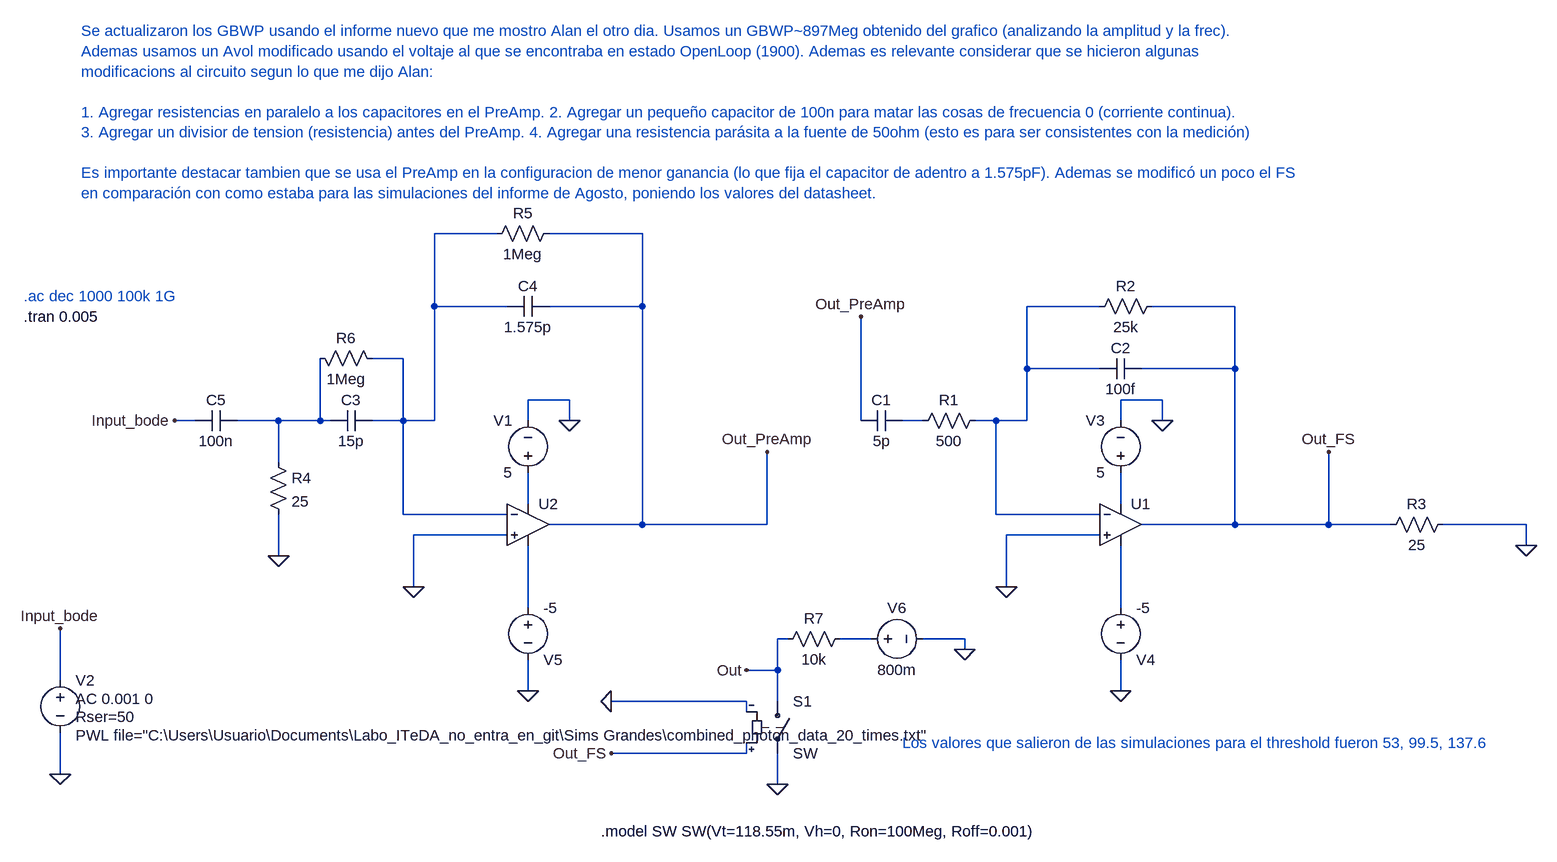
[diagram p0: schematic bode_circuito_completo_con_capacitores_en_preamp_inversor_actualizado.asc]
bode_circuito_completo_con_capacitores_en_preamp_inversor_actualizado.asc, the LTspice schematic file:
Version 4
SHEET 1 2516 1220
WIRE -832 -480 -928 -480
WIRE -608 -480 -752 -480
WIRE -928 -368 -928 -480
WIRE -816 -368 -928 -368
WIRE -608 -368 -608 -480
WIRE -608 -368 -752 -368
WIRE 96 -368 -16 -368
WIRE 304 -368 176 -368
WIRE -976 -288 -1024 -288
WIRE -16 -272 -16 -368
WIRE 96 -272 -16 -272
WIRE 304 -272 304 -368
WIRE 304 -272 160 -272
WIRE -720 -224 -784 -224
WIRE 192 -224 128 -224
WIRE -1296 -192 -1328 -192
WIRE -1168 -192 -1232 -192
WIRE -1104 -192 -1104 -288
WIRE -1104 -192 -1168 -192
WIRE -1088 -192 -1104 -192
WIRE -976 -192 -976 -288
WIRE -976 -192 -1024 -192
WIRE -928 -192 -928 -368
WIRE -928 -192 -976 -192
WIRE -784 -192 -784 -224
WIRE -720 -192 -720 -224
WIRE -272 -192 -272 -352
WIRE -176 -192 -208 -192
WIRE -64 -192 -96 -192
WIRE -16 -192 -16 -272
WIRE -16 -192 -64 -192
WIRE 128 -192 128 -224
WIRE 192 -192 192 -224
WIRE -1168 -128 -1168 -192
WIRE -784 -64 -784 -112
WIRE 128 -64 128 -112
WIRE -976 -48 -976 -192
WIRE -816 -48 -976 -48
WIRE -64 -48 -64 -192
WIRE 96 -48 -64 -48
WIRE -608 -32 -608 -368
WIRE -608 -32 -752 -32
WIRE -416 -32 -416 -144
WIRE -416 -32 -608 -32
WIRE 304 -32 304 -272
WIRE 304 -32 160 -32
WIRE 448 -32 448 -144
WIRE 448 -32 304 -32
WIRE 544 -32 448 -32
WIRE 752 -32 624 -32
WIRE -816 -16 -960 -16
WIRE 96 -16 -48 -16
WIRE 752 0 752 -32
WIRE -1168 16 -1168 -48
WIRE -960 64 -960 -16
WIRE -48 64 -48 -16
WIRE -784 96 -784 0
WIRE 128 96 128 0
WIRE -384 144 -400 144
WIRE -256 144 -304 144
WIRE -112 144 -176 144
WIRE -112 160 -112 144
WIRE -400 192 -400 144
WIRE -400 192 -448 192
WIRE -1504 208 -1504 128
WIRE -784 224 -784 176
WIRE 128 224 128 176
WIRE -448 240 -656 240
WIRE -400 240 -400 192
WIRE -448 256 -448 240
WIRE -448 320 -448 304
WIRE -448 320 -656 320
WIRE -1504 352 -1504 288
WIRE -400 368 -400 320
FLAG 192 -192 0
FLAG -48 64 0
FLAG 448 -144 Out_FS
FLAG 752 0 0
FLAG -272 -352 Out_PreAmp
FLAG -1504 352 0
FLAG -1504 128 Input_bode
FLAG -784 224 0
FLAG -720 -192 0
FLAG -960 64 0
FLAG -416 -144 Out_PreAmp
FLAG -1328 -192 Input_bode
FLAG -1168 16 0
FLAG 128 224 0
FLAG -400 368 0
FLAG -112 160 0
FLAG -448 192 Out
FLAG -656 240 0
FLAG -656 320 Out_FS
SYMBOL res -80 -208 R90
WINDOW 0 0 56 VBottom 2
WINDOW 3 32 56 VTop 2
SYMATTR InstName R1
SYMATTR Value 500
SYMBOL res 192 -384 R90
WINDOW 0 0 56 VBottom 2
WINDOW 3 32 56 VTop 2
SYMATTR InstName R2
SYMATTR Value 25k
SYMBOL voltage 128 -96 R180
WINDOW 0 24 96 Left 2
WINDOW 3 24 16 Left 2
WINDOW 123 0 0 Left 0
WINDOW 39 0 0 Left 0
SYMATTR InstName V3
SYMATTR Value 5
SYMBOL OpAmps\\UniversalOpAmp1 128 -32 R0
SYMATTR InstName U1
SYMATTR Value2 Avol=1900 GBW=897.0831Meg Vos=0
SYMBOL res 640 -48 R90
WINDOW 0 0 56 VBottom 2
WINDOW 3 32 56 VTop 2
SYMATTR InstName R3
SYMATTR Value 25
SYMBOL cap -208 -208 R90
WINDOW 0 0 32 VBottom 2
WINDOW 3 32 32 VTop 2
SYMATTR InstName C1
SYMATTR Value 5p
SYMBOL cap 160 -288 R90
WINDOW 0 0 32 VBottom 2
WINDOW 3 32 32 VTop 2
SYMATTR InstName C2
SYMATTR Value 100f
SYMBOL voltage -784 -96 R180
WINDOW 0 24 96 Left 2
WINDOW 3 24 16 Left 2
WINDOW 123 0 0 Left 0
WINDOW 39 0 0 Left 0
SYMATTR InstName V1
SYMATTR Value 5
SYMBOL voltage -784 80 R0
WINDOW 0 24 96 Left 2
WINDOW 3 24 16 Left 2
WINDOW 123 0 0 Left 0
WINDOW 39 0 0 Left 0
SYMATTR InstName V5
SYMATTR Value -5
SYMBOL OpAmps\\UniversalOpAmp1 -784 -32 R0
SYMATTR InstName U2
SYMATTR Value2 Avol=1900 GBW=897.0831Meg Vos=0
SYMBOL voltage -1504 192 R0
WINDOW 123 24 44 Left 2
WINDOW 39 24 72 Left 2
WINDOW 3 24 100 Left 2
SYMATTR Value2 AC 0.001 0
SYMATTR SpiceLine Rser=50
SYMATTR Value PWL file="C:\Users\Usuario\Documents\Labo_ITeDA_no_entra_en_git\Sims Grandes\combined_photon_data_20_times.txt"
SYMATTR InstName V2
SYMBOL cap -1024 -208 R90
WINDOW 0 0 32 VBottom 2
WINDOW 3 32 32 VTop 2
SYMATTR InstName C3
SYMATTR Value 15p
SYMBOL cap -752 -384 R90
WINDOW 0 0 32 VBottom 2
WINDOW 3 32 32 VTop 2
SYMATTR InstName C4
SYMATTR Value 1.575p
SYMBOL res -1184 -144 R0
SYMATTR InstName R4
SYMATTR Value 25
SYMBOL res -736 -496 R90
WINDOW 0 0 56 VBottom 2
WINDOW 3 32 56 VTop 2
SYMATTR InstName R5
SYMATTR Value 1Meg
SYMBOL res -1120 -304 M90
WINDOW 0 0 56 VBottom 2
WINDOW 3 32 56 VTop 2
SYMATTR InstName R6
SYMATTR Value 1Meg
SYMBOL voltage 128 80 R0
WINDOW 0 24 96 Left 2
WINDOW 3 24 16 Left 2
WINDOW 123 0 0 Left 0
WINDOW 39 0 0 Left 0
SYMATTR InstName V4
SYMATTR Value -5
SYMBOL cap -1232 -208 R90
WINDOW 0 0 32 VBottom 2
WINDOW 3 32 32 VTop 2
SYMATTR InstName C5
SYMATTR Value 100n
SYMBOL sw -400 224 R0
SYMATTR InstName S1
SYMBOL voltage -272 144 R270
WINDOW 0 32 56 VTop 2
WINDOW 3 -32 56 VBottom 2
WINDOW 123 0 0 Left 0
WINDOW 39 0 0 Left 0
SYMATTR InstName V6
SYMATTR Value 800m
SYMBOL res -288 128 R90
WINDOW 0 0 56 VBottom 2
WINDOW 3 32 56 VTop 2
SYMATTR InstName R7
SYMATTR Value 10k
TEXT -1560 -352 Left 2 !.tran 0.005
TEXT -1560 -384 Left 2 ;.ac dec 1000 100k 1G
TEXT -1472 -792 Left 2 ;Se actualizaron los GBWP usando el informe nuevo que me mostro Alan el otro dia. Usamos un GBWP~897Meg obtenido del grafico (analizando la amplitud y la frec).\nAdemas usamos un Avol modificado usando el voltaje al que se encontraba en estado OpenLoop (1900). Ademas es relevante considerar que se hicieron algunas\nmodificacions al circuito segun lo que me dijo Alan: \n \n1. Agregar resistencias en paralelo a los capacitores en el PreAmp. 2. Agregar un pequeño capacitor de 100n para matar las cosas de frecuencia 0 (corriente continua).\n3. Agregar un divisior de tension (resistencia) antes del PreAmp. 4. Agregar una resistencia parásita a la fuente de 50ohm (esto es para ser consistentes con la medición)\n \nEs importante destacar tambien que se usa el PreAmp en la configuracion de menor ganancia (lo que fija el capacitor de adentro a 1.575pF). Ademas se modificó un poco el FS\nen comparación con como estaba para las simulaciones del informe de Agosto, poniendo los valores del datasheet.
TEXT -672 440 Left 2 !.model SW SW(Vt=118.55m, Vh=0, Ron=100Meg, Roff=0.001)
TEXT -208 304 Left 2 ;Los valores que salieron de las simulaciones para el threshold fueron 53, 99.5, 137.6

The netlist it stands for:
* bode_circuito_completo_con_capacitores_en_preamp_inversor_actualizado.asc
R1 N002 N004 500
R2 Out_FS N002 25k
V3 N006 0 5
XU1 0 N002 N006 N008 Out_FS level1 Avol=1900 GBW=897.0831Meg Vos=0 En=0 Enk=0 In=0 Ink=0 Rin=500Meg  ; pins In+ In- V+ V- OUT
R3 0 Out_FS 25
C1 N004 Out_PreAmp 5p
C2 Out_FS N002 100f
V1 N005 0 5
V5 N007 0 -5
XU2 0 N001 N005 N007 Out_PreAmp level1 Avol=1900 GBW=897.0831Meg Vos=0 En=0 Enk=0 In=0 Ink=0 Rin=500Meg  ; pins In+ In- V+ V- OUT
V2 Input_bode 0 PWL file="C:\Users\Usuario\Documents\Labo_ITeDA_no_entra_en_git\Sims Grandes\combined_photon_data_20_times.txt" AC 0.001 0 Rser=50
C3 N001 N003 15p
C4 Out_PreAmp N001 1.575p
R4 N003 0 25
R5 Out_PreAmp N001 1Meg
R6 N003 N001 1Meg
V4 N008 0 -5
C5 N003 Input_bode 100n
S1 Out 0 Out_FS 0 SW
V6 N009 0 800m
R7 N009 Out 10k
.tran 0.005
* .ac dec 1000 100k 1G
* Se actualizaron los GBWP usando el informe nuevo que me mostro Alan el otro dia. Usamos un GBWP~897Meg obtenido del grafico (analizando la amplitud y la frec).
* Ademas usamos un Avol modificado usando el voltaje al que se encontraba en estado OpenLoop (1900). Ademas es relevante considerar que se hicieron algunas
* modificacions al circuito segun lo que me dijo Alan:
* 1. Agregar resistencias en paralelo a los capacitores en el PreAmp. 2. Agregar un pequeño capacitor de 100n para matar las cosas de frecuencia 0 (corriente continua).
* 3. Agregar un divisior de tension (resistencia) antes del PreAmp. 4. Agregar una resistencia parásita a la fuente de 50ohm (esto es para ser consistentes con la medición)
* Es importante destacar tambien que se usa el PreAmp en la configuracion de menor ganancia (lo que fija el capacitor de adentro a 1.575pF). Ademas se modificó un poco el FS
* en comparación con como estaba para las simulaciones del informe de Agosto, poniendo los valores del datasheet.
.model SW SW(Vt=118.55m, Vh=0, Ron=100Meg, Roff=0.001)
* Los valores que salieron de las simulaciones para el threshold fueron 53, 99.5, 137.6
.lib UniversalOpAmp1.lib
.backanno
.end